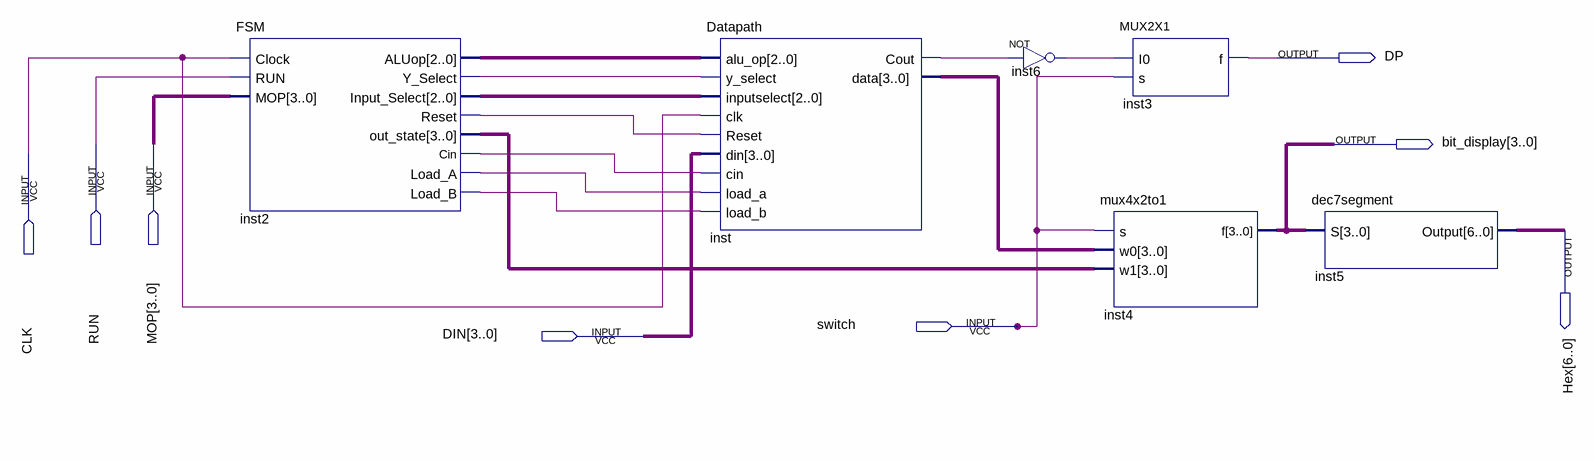
[diagram p0: schematic sheet]
// Quartus schematic Calculator.bdf as structural Verilog: 6 symbols, 8 pins
module Calculator (
  input  RUN,
  input  [3:0] MOP,
  input  CLK,
  input  switch,
  input  [3:0] DIN,
  output DP,
  output [3:0] bit_display,
  output [6:0] Hex
);

  wire inst2_cin, inst2_load_a, inst2_load_b, inst2_reset, inst2_y_select, inst6_out, inst_cout;
  wire [2:0] inst2_aluop, inst2_input_select;
  wire [3:0] inst2_out_state, inst_data;

  FSM inst2 (
    .Clock(CLK), .RUN(RUN), .MOP(MOP), .ALUop(inst2_aluop), .Y_Select(inst2_y_select),
    .Input_Select(inst2_input_select), .Reset(inst2_reset), .out_state(inst2_out_state), .Cin(inst2_cin),
    .Load_A(inst2_load_a), .Load_B(inst2_load_b));
  Datapath inst (
    .alu_op(inst2_aluop), .y_select(inst2_y_select), .inputselect(inst2_input_select), .clk(CLK),
    .Reset(inst2_reset), .din(DIN), .cin(inst2_cin), .load_a(inst2_load_a), .load_b(inst2_load_b),
    .Cout(inst_cout), .data(inst_data));
  not inst6 (inst6_out, inst_cout);
  mux4x2to1 inst4 (.s(switch), .w0(inst_data), .w1(inst2_out_state), .f(bit_display));
  MUX2X1 inst3 (.I0(inst6_out), .s(switch), .f(DP));
  dec7segment inst5 (.S(bit_display), .Output(Hex));
endmodule
